# EAGLE board decel_control (EAGLE 9.6.2), part 1 of 2
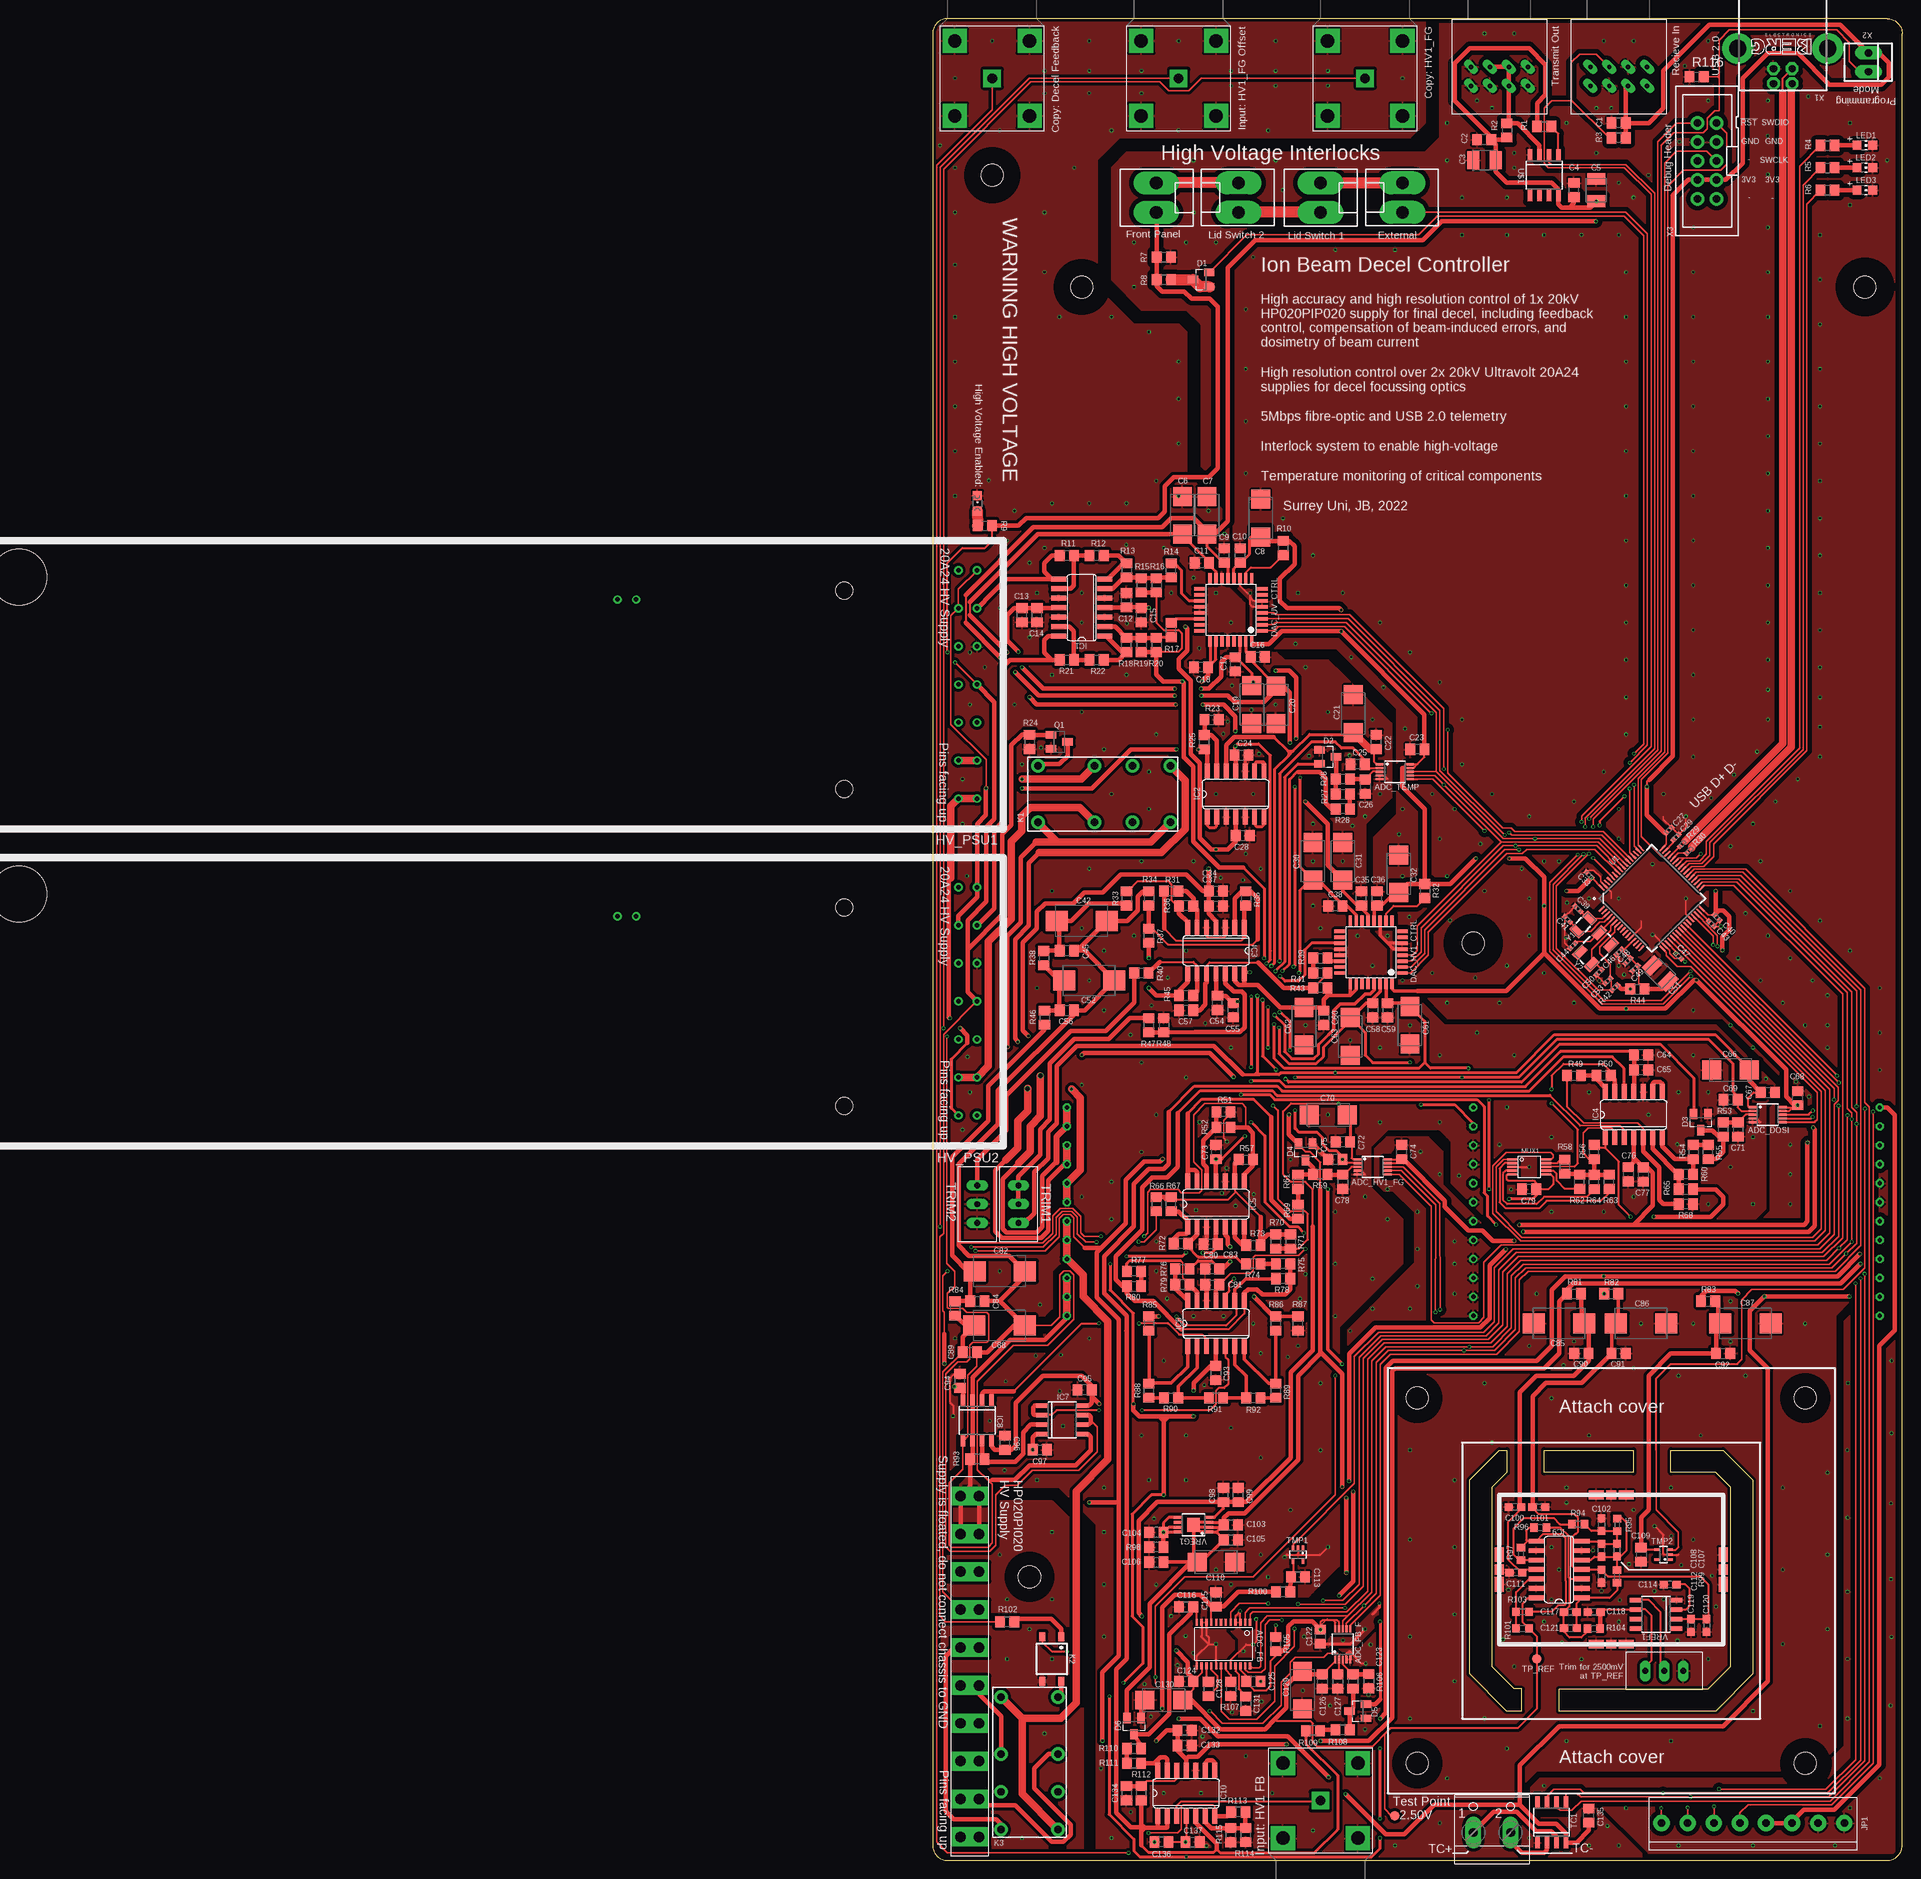
[diagram p8: board, top side]
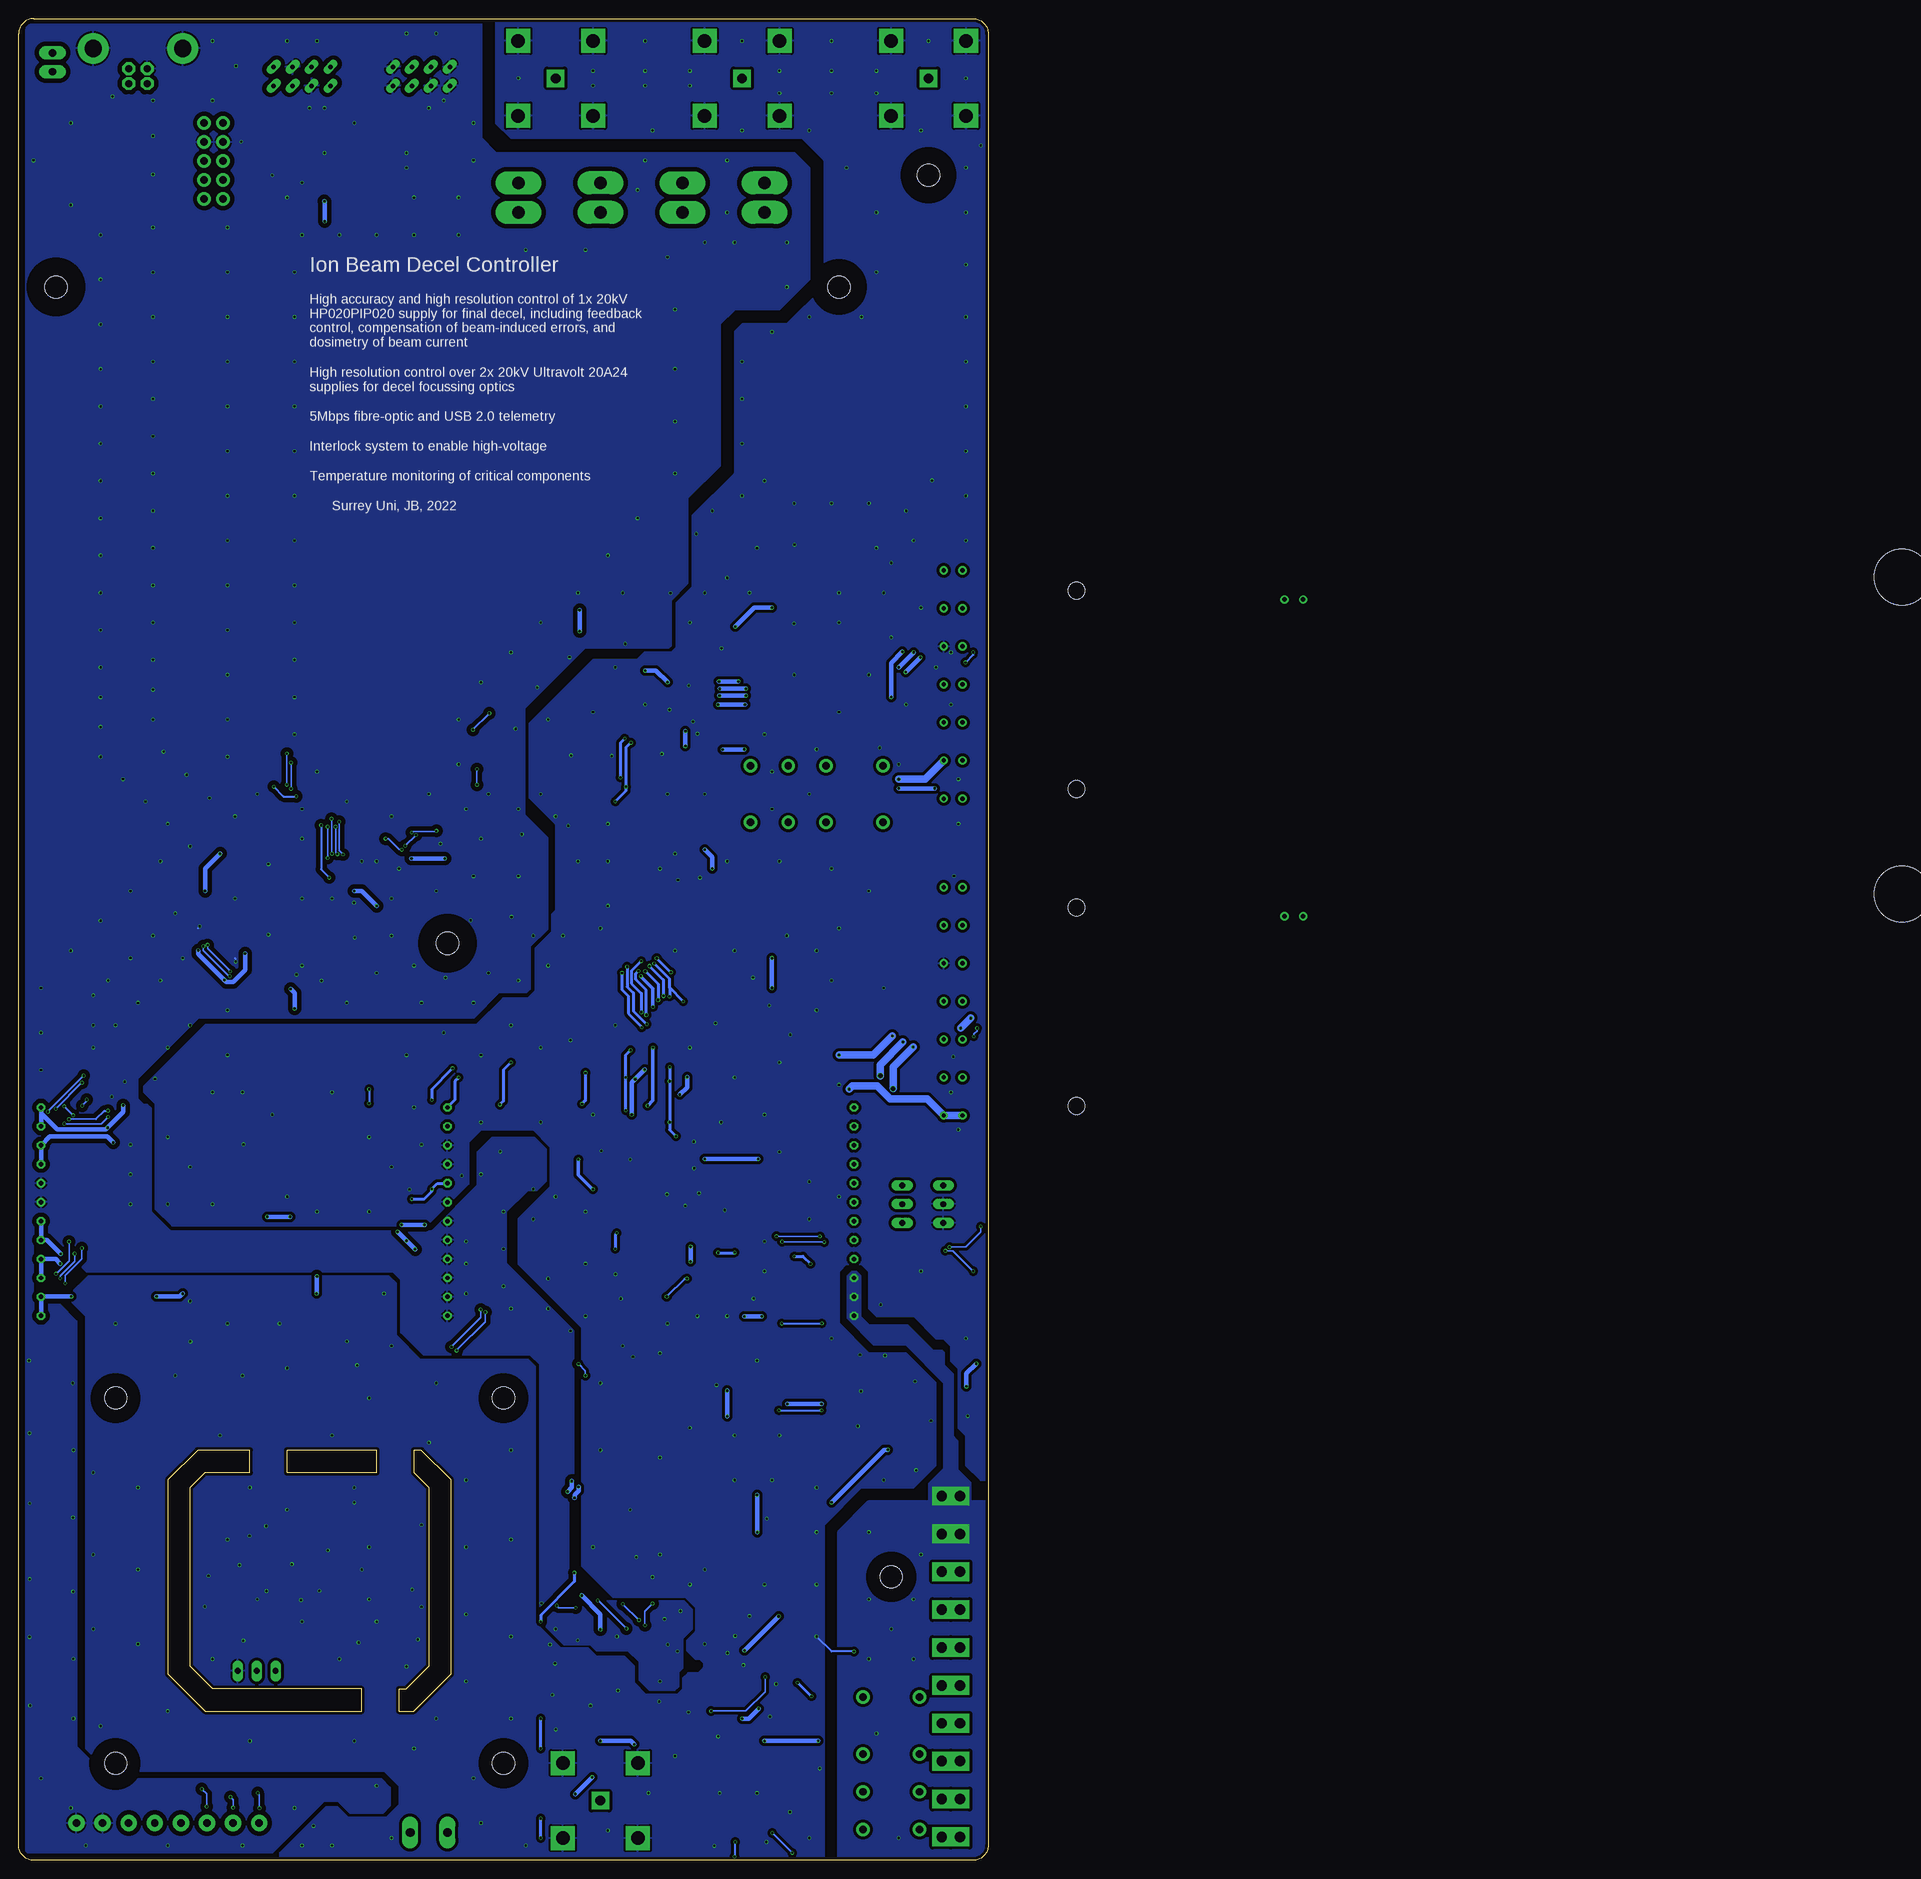
[diagram p9: board, bottom side, seen from below]

Size 130 x 247 mm. Coordinates in mm from the lower left corner, seen from the top.
Outline: 2,0 128,0 arc90 130,2 130,245 arc90 128,247 2,247 arc90 0,245 0,2 arc90 2,0
Outline: 104,23 107,26 107,50 105,52 99,52 99,55 106,55 110,51 110,25 105,20 84,20 84,23 104,23
Outline: 94,52 82,52 82,55 94,55 94,52
Outline: 77,52 75,50 75,26 78,23 79,23 79,20 77,20 72,25 72,51 76,55 77,55 77,52
Copper layers (1*16): Top 0.035mm / dielectric 1.6mm / Bottom 0.035mm
Design rules "jlcpcb-2layers": minimum track width 5mil, minimum drill 0.3mm, track to track 5mil, track to pad 5mil, pad to pad 5mil, via to via 5mil, smd to smd 5mil, copper to edge 0.2mm, drill to drill 6mil, minimum pad ring 10mil, minimum via ring 3mil, stop-mask expansion 4mil, vias tented up to drill 0mil, thermal gap 10mil
Holes 3 mm at 8,226 65,62 117,62 117,13 65,13 13,38
tRestrict: area 5.2,223.2 to 10.8,228.8; area 62.2,10.2 to 67.8,15.8; area 114.2,10.2 to 119.8,15.8; area 114.2,59.2 to 119.8,64.8; area 62.2,59.2 to 67.8,64.8; area 10.2,35.2 to 15.8,40.8
bRestrict: area 5.2,223.2 to 10.8,228.8; area 62.2,10.2 to 67.8,15.8; area 114.2,10.2 to 119.8,15.8; area 114.2,59.2 to 119.8,64.8; area 62.2,59.2 to 67.8,64.8; area 10.2,35.2 to 15.8,40.8

## Footprints (pad centres in the part's own frame; a part is rotated, then mirrored left to right if it is on the bottom)
MSOP10 = smd 0.3 x 1: 1 -1,-2.05; 2 -0.5,-2.05; 3 0,-2.05; 4 0.5,-2.05; 5 1,-2.05; 6 1,2.05; 7 0.5,2.05; 8 0,2.05; 9 -0.5,2.05; 10 -1,2.05
TSSOP24 = smd 0.305 x 0.991: 1 -3.575,-2.918; 2 -2.925,-2.918; 3 -2.275,-2.918; 4 -1.625,-2.918; 5 -0.975,-2.918; 6 -0.325,-2.918; 7 0.325,-2.918; 8 0.975,-2.918; 9 1.625,-2.918; 10 2.275,-2.918; 11 2.925,-2.918; 12 3.575,-2.918; 13 3.575,2.918; 14 2.925,2.918; 15 2.275,2.918; 16 1.625,2.918; 17 0.975,2.918; 18 0.325,2.918; 19 -0.325,2.918; 20 -0.975,2.918; 21 -1.625,2.918; 22 -2.275,2.918; 23 -2.925,2.918; 24 -3.575,2.918
BNC_RS = drill 1.8 square: P$1 -5.02,-5.03; P$2 -5.02,5.02; P$3 5.03,5.02; P$4 5.03,-5.03 | drill 1.3 square: P$5 0.005,-0.005
C0805 = smd 1.3 x 1.5: 1 -0.95,0; 2 0.95,0
SMC_B = smd 1.6 x 2.4: + -1.5,0; - 1.5,0
C/6032-28R = smd 2.55 x 2.5: + 2.525,0; - -2.525,0
0402-TIGHT = smd 0.6 x 0.6: 1 -0.5,0; 2 0.5,0
D/7343-31W = smd 2.95 x 2.7: + 3.375,0; - -3.375,0
C0603 = smd 1.1 x 1: 1 -0.85,0; 2 0.85,0
RFI_SHIELD_CLIP = smd 1.4 x 1.2: P$1 0,0 | smd 2 x 1.2: P$2 -2,0; P$3 2,0
PSU_CONNECTION = drill 1.4 square: P$1 0,0; P$2 5.08,0; P$3 10.16,0; P$4 15.24,0; P$5 20.32,0; P$6 25.4,0; P$7 30.48,0; P$8 35.56,0; P$9 40.64,0; P$10 45.72,0; P$11 0,-2.46; P$12 5.08,-2.46; P$13 10.16,-2.46; P$14 15.24,-2.46; P$15 20.32,-2.46; P$16 25.4,-2.46; P$17 30.48,-2.46; P$18 35.56,-2.46; P$19 40.64,-2.46; P$20 45.72,-2.46
SOT23 = smd 1 x 1.4: 1 -0.95,-1.1; 2 0.95,-1.1; 3 0,1.1
TQFP-32 = smd 0.45 x 1.45: P$1 0,0; P$2 0.8,0; P$3 1.6,0; P$4 2.4,0; P$5 3.2,0; P$6 4,0; P$7 4.8,0; P$8 5.6,0; P$17 5.6,8.4; P$18 4.8,8.4; P$19 4,8.4; P$20 3.2,8.4; P$21 2.4,8.4; P$22 1.6,8.4; P$23 0.8,8.4; P$24 0,8.4 | smd 1.45 x 0.45: P$9 7,1.4; P$10 7,2.2; P$11 7,3; P$12 7,3.8; P$13 7,4.6; P$14 7,5.4; P$15 7,6.2; P$16 7,7; P$25 -1.4,7; P$26 -1.4,6.2; P$27 -1.4,5.4; P$28 -1.4,4.6; P$29 -1.4,3.8; P$30 -1.4,3; P$31 -1.4,2.2; P$32 -1.4,1.4
KK-156-2 = drill 1.7 pad 2.184 long: 1 -1.98,0; 2 1.98,0
HFBR-X41XZ = drill 0.6 long: P$1 0,-3.81; P$2 0,-1.27; P$3 0,1.27; P$4 0,3.81; P$5 2.54,3.81; P$6 2.54,1.27; P$7 2.54,-1.27; P$8 2.54,-3.81
CHIPLED_0805 = smd 1.2 x 1.2: A 0,-1.05; C 0,1.05
ULTRAVOLT_20A = drill 0.6: J1-1 3.5,-4.1; J1-2 3.5,-9.2; J1-3 3.5,-14.3; J1-4 3.5,-19.4; J1-5 3.5,-24.5; J1-6 3.5,-29.6; J1-7 3.5,-34.7; J1-8 6,-4.1; J1-9 6,-9.2; J1-10 6,-14.3; J1-11 6,-19.4; J1-12 6,-24.5; J1-13 6,-29.6; J1-14 6,-34.7; J2-1 49.2,-30.8; J2-2 51.7,-30.8 | hole 2.3: 21.3,-5.4; 21.3,-32 | hole 7.5: 132,-33.8
SO14 = smd 0.66 x 2.032: 1 -3.81,-3.073; 2 -2.54,-3.073; 3 -1.27,-3.073; 4 0,-3.073; 5 1.27,-3.073; 6 2.54,-3.073; 7 3.81,-3.073; 8 3.81,3.073; 9 2.54,3.073; 10 1.27,3.073; 11 0,3.073; 12 -1.27,3.073; 13 -2.54,3.073; 14 -3.81,3.073
SOIC8 = smd 0.6 x 1.5: 1 -1.905,-2.75; 2 -0.635,-2.75; 3 0.635,-2.75; 4 1.905,-2.75; 5 1.905,2.75; 6 0.635,2.75; 7 -0.635,2.75; 8 -1.905,2.75
1X4MTA = drill 1.676 long: 1 5.944,0; 2 1.981,0; 3 -1.981,0; 4 -5.944,0
1X08-3.5MM = drill 1 pad 2.184: 1 -12.25,0; 2 -8.75,0; 3 -5.25,0; 4 -1.75,0; 5 1.75,0; 6 5.25,0; 7 8.75,0; 8 12.25,0
FINDER-30.22 = drill 1 pad 1.6: 11 -1.27,-3.81; 12 3.81,-3.81; 14 8.89,-3.81; 21 -1.27,3.81; 22 3.81,3.81; 24 8.89,3.81; A1 -8.89,-3.81; A2 -8.89,3.81
SOP04 = smd 0.8 x 1.2: 1 -1.27,-3; 2 1.27,-3; 3 1.27,3; 4 -1.27,3
CHIP-LED0805 = smd 1.2 x 1.2: A 0,-1.05; C 0,1.05
VSSOP-10 = smd 1.45 x 0.3: P$1 -2.2,1; P$2 -2.2,0.5; P$3 -2.2,0; P$4 -2.2,-0.5; P$5 -2.2,-1; P$6 2.2,-1; P$7 2.2,-0.5; P$8 2.2,0; P$9 2.2,0.5; P$10 2.2,1
R0805 = smd 1.3 x 1.5: 1 -0.95,0; 2 0.95,0
R0603 = smd 1 x 1.1: 1 -0.85,0; 2 0.85,0
SC70-5L = smd 0.35 x 0.8: 1 -0.65,-0.85; 2 0,-0.85; 3 0.65,-0.85; 4 0.65,0.85; 5 -0.65,0.85
B1,27 = smd 1.27 x 1.27: TP 0,0
BOURNS_TRIMPOT = drill 0.8 long: P$1 0,-2.54; P$2 0,0; P$3 0,2.54
TQFP64 = smd 0.22 x 1: 1 -3.75,-5.75; 2 -3.25,-5.75; 3 -2.75,-5.75; 4 -2.25,-5.75; 5 -1.75,-5.75; 6 -1.25,-5.75; 7 -0.75,-5.75; 8 -0.25,-5.75; 9 0.25,-5.75; 10 0.75,-5.75; 11 1.25,-5.75; 12 1.75,-5.75; 13 2.25,-5.75; 14 2.75,-5.75; 15 3.25,-5.75; 16 3.75,-5.75; 33 3.75,5.75; 34 3.25,5.75; 35 2.75,5.75; 36 2.25,5.75; 37 1.75,5.75; 38 1.25,5.75; 39 0.75,5.75; 40 0.25,5.75; 41 -0.25,5.75; 42 -0.75,5.75; 43 -1.25,5.75; 44 -1.75,5.75; 45 -2.25,5.75; 46 -2.75,5.75; 47 -3.25,5.75; 48 -3.75,5.75 | smd 1 x 0.22: 17 5.75,-3.75; 18 5.75,-3.25; 19 5.75,-2.75; 20 5.75,-2.25; 21 5.75,-1.75; 22 5.75,-1.25; 23 5.75,-0.75; 24 5.75,-0.25; 25 5.75,0.25; 26 5.75,0.75; 27 5.75,1.25; 28 5.75,1.75; 29 5.75,2.25; 30 5.75,2.75; 31 5.75,3.25; 32 5.75,3.75; 49 -5.75,3.75; 50 -5.75,3.25; 51 -5.75,2.75; 52 -5.75,2.25; 53 -5.75,1.75; 54 -5.75,1.25; 55 -5.75,0.75; 56 -5.75,0.25; 57 -5.75,-0.25; 58 -5.75,-0.75; 59 -5.75,-1.25; 60 -5.75,-1.75; 61 -5.75,-2.25; 62 -5.75,-2.75; 63 -5.75,-3.25; 64 -5.75,-3.75
POWER_BOARD_DECEL = drill 0.6 octagon: P$1 142.97,3; P$2 140.43,3; P$3 137.89,3; P$4 135.35,3; P$5 132.81,3; P$6 130.27,3; P$7 127.73,3; P$8 125.19,3; P$9 122.65,3; P$10 120.11,3; P$11 117.57,3; P$12 115.03,3; P$13 115.03,57.5; P$14 117.57,57.5; P$15 120.11,57.5; P$16 122.65,57.5; P$17 125.19,57.5; P$18 127.73,57.5; P$19 130.27,57.5; P$20 132.81,57.5; P$21 135.35,57.5; P$22 137.89,57.5; P$23 140.43,57.5; P$24 142.97,57.5; P$25 142.97,112; P$26 140.43,112; P$27 137.89,112; P$28 135.35,112; P$29 132.81,112; P$30 130.27,112; P$31 127.73,112; P$32 125.19,112; P$33 122.65,112; P$34 120.11,112; P$35 117.57,112; P$36 115.03,112 | hole 3: 5,5; 93,57.5; 5,110
MSOP8 = smd 0.4 x 1.2: 1 -0.975,-2.05; 2 -0.325,-2.05; 3 0.325,-2.05; 4 0.975,-2.05; 5 0.975,2.05; 6 0.325,2.05; 7 -0.325,2.05; 8 -0.975,2.05 | smd 1.88 x 1.68: BOTTOM 0,0
PN61729-S = drill 0.95 octagon: 1 1.25,4.71; 2 -1.25,4.71; 3 -1.25,2.71; 4 1.25,2.71 | drill 2.3 pad 2.9: S1 -6.02,0; S2 6.02,0
22-23-2021 = drill 1 long: 1 -1.27,0; 2 1.27,0
PAK100/2500-10 = drill 1 pad 1.422: 1 -5.08,-1.27; 2 -5.08,1.27; 3 -2.54,-1.27; 4 -2.54,1.27; 5 0,-1.27; 6 0,1.27; 7 2.54,-1.27; 8 2.54,1.27; 9 5.08,-1.27; 10 5.08,1.27
W237-102 = drill 1.194 long: 1 -2.5,-1.27; 2 2.5,-1.27
CRYSTAL-SMD-3.2X1.5MM = smd 1 x 1.8: P$1 -1.25,0; P$2 1.25,0
CRYSTAL-SMD-5X3.2-4PAD = smd 1.9 x 1.1: 1 -1.85,-1.15; 2 1.85,-1.15; 3 1.85,1.15; 4 -1.85,1.15

## Placement (x,y rotation side)
ADC_FAST_HV1_FB  MCP33131  [MSOP10]  55,29 0 top
ADC_HV1_ELECTRODE_CURRENT  MCP33131  [MSOP10]  112,100 270 top
ADC_HV1_FG  MCP33131  [MSOP10]  59,93 270 top
ADC_SLOW_HV1_FB  MAX11270  [TSSOP24]  39,29 180 top
ADC_TEMP_DAC_HV1_CTRL  MCP33131  [MSOP10]  62,146 270 top
BNC_DECEL_COPY  BNC_RS  [BNC_RS]  8,239 270 top
C1  100n  [C0805]  92,233 180 top
C2  100n  [C0805]  73.95,230.78 180 top
C3  10u  [SMC_B]  74,228 180 top
C4  100n  [C0805]  86,224 90 top
C5  10u  [SMC_B]  89,224 90 top
C6  10u  [C/6032-28R]  33.5,180.4 90 top
C7  10u  [C/6032-28R]  36.8,180.4 270 top
C8  10u  [C/6032-28R]  44.01,180.01 270 top
C9  100n  [C0805]  39.1,175 90 top
C10  100n  [C0805]  41.24,175 90 top
C11  100n  [C0805]  36.1,174 180 top
C12  1n  [C0805]  26,169 90 top
C13  100n  [C0805]  12,167 90 top
C14  1n  [C0805]  14,167 90 top
C15  100n  [C0805]  28,167 270 top
C16  100n  [C0805]  43.6,161.4 0 top
C17  100n  [C0805]  40.57,160.4 270 top
C18  100n  [C0805]  36,160 180 top
C19  10u  [C/6032-28R]  42.8,155 270 top
C20  10u  [C/6032-28R]  46.04,154.97 90 top
C21  10u  [C/6032-28R]  56.4,153.8 270 top
C22  10n  [C0805]  59.5,150 90 top
C23  100n  [C0805]  65,149 180 top
C24  100n  [C0805]  41.43,148.24 0 top
C25  1u  [C0805]  57,147 180 top
C26  1.7n  [C0805]  58,144 270 top
C27  0.1uF  [0402-TIGHT]  98.73,138.16 45 top
C28  100n  [C0805]  41.59,137.43 0 top
C29  2.2uF  [0402-TIGHT]  99.69,137.21 45 top
C30  10u  [C/6032-28R]  51,134 90 top
C31  10u  [C/6032-28R]  55,134 270 top
C32  10u  [C/6032-28R]  62.5,132.3 270 top
C33  0.1uF  [0402-TIGHT]  88,132.15 135 top
C34  100n  [C0805]  38,130 0 top
C35  100n  [C0805]  57.5,129 90 top
C36  100n  [C0805]  59.6,129 90 top
C37  1n  [C0805]  38,128 0 top
C38  100n  [C0805]  54,128 180 top
C39  15pF  [0402-TIGHT]  86.54,127.61 135 top
C40  0.1uF  [0402-TIGHT]  105.18,126.43 315 top
C41  15pF  [0402-TIGHT]  85.12,126.19 135 top
C42  100u  [D/7343-31W]  20,126 180 top
C43  2.2uF  [0402-TIGHT]  104.43,125.62 315 top
C44  22pF  [0402-TIGHT]  85.83,122.66 225 top
C45  100n  [C0805]  18,122 0 top
C46  0.1uF  [0402-TIGHT]  92.04,121.82 225 top
C47  0.1uF  [0402-TIGHT]  100,121.27 315 top
C48  1.0uF  [0402-TIGHT]  93.22,120.63 225 top
C49  4.7uF  [0402-TIGHT]  94.21,119.63 225 top
C50  22pF  [0402-TIGHT]  89.36,119.12 225 top
C51  10u  [SMC_B]  97.56,118.95 135 top
C52  100u  [D/7343-31W]  21,118 180 top
C53  0.1uF  [0402-TIGHT]  90.54,117.95 225 top
C54  1n  [C0805]  38.2,115 90 top
C55  100n  [C0805]  40.3,114.01 90 top
C56  100n  [C0805]  18,114 0 top
C57  1u  [C0805]  34,114 180 top
C58  100n  [C0805]  59,114 270 top
C59  100n  [C0805]  61,114 270 top
C60  100n  [C0805]  52.45,112.98 270 top
C61  10u  [C/6032-28R]  64,112 90 top
C62  10u  [C/6032-28R]  49.81,111.87 90 top
C63  10u  [C/6032-28R]  56,110.5 270 top
C64  100n  [C0805]  95,108 180 top
C65  1n  [C0805]  95,106 180 top
C66  10u  [C/6032-28R]  107,106 0 top
C67  10n  [C0805]  112,103 0 top
C68  100n  [C0805]  115.99,102.22 90 top
C69  1u  [C0805]  107,102 180 top
C70  10u  [C/6032-28R]  53.05,99.97 0 top
C71  1.7n  [C0805]  108,98 270 top
C72  10n  [C0805]  55,96.36 180 top
C73  10n  [C0805]  38,95 270 top
C74  100n  [C0805]  62.91,95 90 top
C75  1u  [C0805]  54,94 180 top
C76  100n  [C0805]  93.26,92 270 top
C77  1n  [C0805]  95.28,91.98 270 top
C78  1.7n  [C0805]  55,91 270 top
C79  100n  [C0805]  80,90 180 top
C80  10n  [C0805]  37.29,82.63 180 top
C81  2n  [C0805]  37.5,79.3 180 top
C82  100u  [D/7343-31W]  9,79 180 top
C83  10n  [C0805]  37.5,77.2 0 top
C84  100n  [C0805]  6,75 0 top
C85  100u  [D/7343-31W]  84,72 0 top
C86  100u  [D/7343-31W]  95,72 180 top
C87  100u  [D/7343-31W]  109,72 180 top
C88  100u  [D/7343-31W]  8.97,71.73 180 top
C89  100n  [C0805]  5,68.15 0 top
C90  100n  [C0805]  87,68 180 top
C91  100n  [C0805]  92,68 0 top
C92  100n  [C0805]  106,68 0 top
C93  10n  [C0805]  37.97,65.37 270 top
C94  10n  [C0805]  3.67,64.3 90 top
C95  10n  [C0805]  20.39,63.08 180 top
C96  10n  [C0805]  9.71,56 90 top
C97  10n  [C0805]  14.39,55.08 0 top
C98  1n  [C0805]  39,49 90 top
C99  1u  [C0805]  41,49 90 top
C100  100n  [C0603]  78.1,47.4 180 top
C101  100n  [C0603]  81.3,47.4 0 top
C102  10u  [C0603]  89.67,45.03 270 top
C103  100n  [C0805]  40,45 0 top
C104  100n  [C0805]  30,44 180 top
C105  1u  [C0805]  40,43 0 top
C106  1u  [C0805]  30,42 180 top
C107  22u  [C0603]  91.8,41.6 90 top
C108  22u  [C0603]  89.68,41.58 90 top
C109  100n  [C0805]  95,41 270 top
C110  10u  [C/6032-28R]  38,40 180 top
C111  1n  [C0603]  78.2,38.6 180 top
C112  1n  [C0603]  89.7,38.1 270 top
C113  1u  [C0805]  49,38 0 top
C114  2u2  [C0603]  98.9,37 180 top
C115  1u  [C0805]  38,35 90 top
C116  10n_C0G  [C0805]  34,34 0 top
C117  22u  [C0603]  85.5,33.32 0 top
C118  10u  [C0603]  88.7,33.3 180 top
C119  10n  [C0603]  101.7,31.5 270 top
C120  2u2  [C0603]  103.8,31.5 270 top
C121  22u  [C0603]  85.52,31.12 0 top
C122  100n  [C0805]  52,30 270 top
C123  1.7n  [C0805]  58.47,24.03 270 top
C124  10n  [C0805]  34,24 0 top
C125  1u  [C0805]  43,24 0 top
C126  10n  [C0805]  52.27,23.99 270 top
C127  1u  [C0805]  54.33,23.99 270 top
C128  10n_C0G  [C0805]  37,23 270 top
C129  10u  [C/6032-28R]  49.6,22.84 90 top
C130  10u  [C/6032-28R]  31,21.5 0 top
C131  1u  [C0805]  42,21 270 top
C132  100n  [C0805]  33.81,17.42 180 top
C133  1n  [C0805]  33.81,15.4 180 top
C134  1u  [C0805]  26,9 270 top
C135  100n  [C0805]  88,6 90 top
C136  100n  [C0805]  30.7,2.46 180 top
C137  1n  [C0805]  34.87,2.46 0 top
CLIP1  RFI_SHIELD_CLIP  [RFI_SHIELD_CLIP]  91,49 180 top
CLIP2  RFI_SHIELD_CLIP  [RFI_SHIELD_CLIP]  76,39 90 top
CLIP3  RFI_SHIELD_CLIP  [RFI_SHIELD_CLIP]  106,39 90 top
CLIP4  RFI_SHIELD_CLIP  [RFI_SHIELD_CLIP]  91,29 180 top
CONN1  PSU_CONNECTOR  [PSU_CONNECTION]  3.77,3.14 90 top
D1  BAS40-04  [SOT23]  36,212 90 top
D2  BAS40-04  [SOT23]  53,148 270 top
D3  BAS40-04  [SOT23]  103,99 180 top
D4  BAS40-04  [SOT23]  50,95 180 top
D5  BAS40-04  [SOT23]  57,20 90 top
D6  BAS40-04  [SOT23]  27,18 180 top
DAC_HV1_CTRL  AD5763  [TQFP-32]  63,119 90 top
DAC_ULTRAVOLT_CTRL  AD5763  [TQFP-32]  44.2,164.91 90 top
EXT_INTERLOCK  [KK-156-2]  63,223 90 top
F_RX1  HFBR-2412-TZ  [HFBR-X41XZ]  92,238 90 top
F_TX1  HFBR-1412-TZ  [HFBR-X41XZ]  76,238 90 top
FRONT_PANEL_INTERLOCK  [KK-156-2]  30,223 270 top
HV_ENABLED_LED  [CHIPLED_0805]  6,182 0 top
HV_PSU1  ULTRAVOLT_20A  [ULTRAVOLT_20A]  9.46,138.3 180 top
HV_PSU2  ULTRAVOLT_20A  [ULTRAVOLT_20A]  9.46,95.8 180 top
IC1  ADA4522-4  [SO14]  20,168 90 top
IC2  ADA4522-4  [SO14]  40.63,143 0 top
IC3  ADA4522-4  [SO14]  38,122 180 top
IC4  ADA4522-4  [SO14]  94,100 0 top
IC5  ADA4522-4  [SO14]  38,88 0 top
IC6  ADA4522-4  [SO14]  38,72 0 top
IC7  AD8034  [SOIC8]  17.39,59.08 270 top
IC8  AD8034  [SOIC8]  6,59 180 top
IC9  ADA4522-4  [SO14]  84,39 90 top
IC10  ADA4522-4  [SO14]  34,9 0 top
IP_BNC_HV1_FB  BNC_RS  [BNC_RS]  52,8 90 top
IP_BNC_HV1_PSU_EXTERNAL_OFFSET  BNC_RS  [BNC_RS]  33,239 270 top
J1  [1X4MTA]  -127,-19 0 top  (outside the outline)
JP1  [1X08-3.5MM]  110,5 0 top
K1  FINDER-30.22  [FINDER-30.22]  23,143 0 top
K2  AQY41SOP  [SOP04]  16,27 180 top
K3  FINDER-30.22  [FINDER-30.22]  13,13 270 top
LED1  [CHIP-LED0805]  125,230 270 top
LED2  [CHIP-LED0805]  125,227 270 top
LED3  [CHIP-LED0805]  125,224 270 top
LID1_INTERLOCK  [KK-156-2]  52,223 270 top
LID2_INTERLOCK  [KK-156-2]  41,223 90 top
MUX1  TMUX1104  [VSSOP-10]  80,93 0 top
OP_BNC_HV1_FG_COPY  BNC_RS  [BNC_RS]  58,239 270 top
Q1  [SOT23]  17,150 270 top
R1  1k  [R0805]  82,232.54 0 top
R2  88  [R0805]  77,232 270 top
R3  560  [R0805]  92,231 180 top
R4  1000  [R0805]  120,230 0 top
R5  1000  [R0805]  120,227 0 top
R6  1000  [R0805]  120,224 0 top
R7  10k  [R0805]  31,215 180 top
R8  100  [R0805]  31,212 0 top
R9  200  [R0805]  7,179 0 top
R10  10k  [R0805]  47,176 270 top
R11  1000  [R0805]  18,175 0 top
R12  1000  [R0805]  22,175 0 top
R13  11k  [R0805]  26,173 270 top
R14  18k  [R0805]  32,173 90 top
R15  18k  [R0805]  28,171 270 top
R16  18k  [R0805]  30,171 270 top
R17  18k  [R0805]  32,165 90 top
R18  11k  [R0805]  26,163 90 top
R19  18k  [R0805]  28,163 270 top
R20  18k  [R0805]  30,163 270 top
R21  1000  [R0805]  18,161 0 top
R22  1000  [R0805]  22,161 0 top
R23  1000  [R0805]  37.42,152.98 0 top
R24  10k  [R0805]  13,150 270 top
R25  1000  [R0805]  36.43,149.96 90 top
R26  22  [R0805]  55,145 180 top
R27  1k  [R0805]  55,143 0 top
R28  1k  [R0805]  55,141 180 top
R29  22  [0402-TIGHT]  100.56,136.33 225 top
R30  22  [0402-TIGHT]  101.46,135.43 225 top
R31  10k  [R0805]  32,130 0 top
R32  10k  [R0805]  66,130 270 top
R33  10  [R0805]  26,129 270 top
R34  10k  [R0805]  29,129 270 top
R35  10k  [R0805]  42,129 270 top
R36  10k  [R0805]  34,128 180 top
R37  10k  [R0805]  29,124 90 top
R38  10  [R0805]  14.92,121 270 top
R39  1000  [R0805]  52,121 0 top
R40  7500  [R0805]  28,119 180 top
R41  1000  [R0805]  52,119 180 top
R42  5.1k  [0402-TIGHT]  91.47,117.05 45 top
R43  1000  [R0805]  52,117 180 top
R44  10  [R0805]  94.49,116.85 0 top
R45  20000  [R0805]  34,116 0 top
R46  10  [R0805]  15,113 270 top
R47  15000  [R0805]  29,112 90 top
R48  68000  [R0805]  31,112 270 top
R49  1000  [R0805]  86.01,105.26 0 top
R50  1000  [R0805]  89.99,105.26 0 top
R51  1k  [R0805]  39,100.38 180 top
R52  10k  [R0805]  39,98.27 0 top
R53  22  [R0805]  106,98 270 top
R54  1k  [R0805]  102,95 270 top
R55  1k  [R0805]  104,95 90 top
R56  1000  [R0805]  88.72,94.98 90 top
R57  1000  [R0805]  42,94 0 top
R58  1000  [R0805]  84.75,93.03 270 top
R59  22  [R0805]  52,92 180 top
R60  1000  [R0805]  101,92 180 top
R61  1k  [R0805]  49,91 270 top
R62  100  [R0805]  86.77,91 90 top
R63  1000  [R0805]  90.71,91 90 top
R64  1000  [R0805]  88.71,90.97 90 top
R65  1000  [R0805]  101,90 0 top
R66  dnf  [R0805]  30,88 270 top
R67  1000  [R0805]  32,88 90 top
R68  1000  [R0805]  101,88 180 top
R69  1k  [R0805]  49,87 270 top
R70  1000  [R0805]  46,83 270 top
R71  1000  [R0805]  48,83 270 top
R72  390  [R0805]  33.3,82.7 180 top
R73  1000  [R0805]  43,82.5 0 top
R74  20k  [R0805]  43,80 180 top
R75  330  [R0805]  47,80 180 top
R76  100k  [R0805]  33.5,79.3 0 top
R77  270  [R0805]  27,79 180 top
R78  1000  [R0805]  47,78 180 top
R79  1800  [R0805]  33.5,77.2 180 top
R80  430  [R0805]  27,77 0 top
R81  10  [R0805]  86,76 0 top
R82  10  [R0805]  91,76 0 top
R83  10  [R0805]  104,75 0 top
R84  10  [R0805]  3,74 270 top
R85  1000  [R0805]  29,72 270 top
R86  1000  [R0805]  46,72 270 top
R87  1000  [R0805]  49,72 90 top
R88  1300  [R0805]  29,63 90 top
R89  1300  [R0805]  46,63 270 top
R90  150.0  [R0805]  32,62 180 top
R91  1000  [R0805]  38,62 180 top
R92  150.0  [R0805]  43,62 180 top
R93  10k  [R0805]  6,53.8 180 top
R94  7k32  [R0603]  86.57,45.08 180 top
R95  5k11  [R0603]  91.8,45 270 top
R96  7k32  [R0603]  81.48,44.62 0 top
R97  7k32  [R0603]  78.9,41.1 90 top
R98  10k  [R0805]  30,40 0 top
R99  7k32  [R0603]  91.78,38.08 90 top
R100  100  [R0805]  47,36 180 top
R101  7k32  [R0603]  79.1,33.33 180 top
R102  560  [R0805]  10,32 0 top
R103  7k32  [R0603]  79.1,31.1 0 top
R104  7k32  [R0603]  88.67,31.08 180 top
R105  10k  [R0805]  46,29 270 top
R106  22  [R0805]  56.38,23.99 270 top
R107  10k  [R0805]  40,23 270 top
R108  1k  [R0805]  54.99,17.5 180 top
R109  1k  [R0805]  51.01,17.38 180 top
R110  1k  [R0805]  27,15 0 top
R111  1k  [R0805]  27,13 180 top
R112  1k  [R0805]  28,9 90 top
R113  82k  [R0805]  40.99,6.48 180 top
R114  1000k  [R0805]  42.01,3.39 90 top
R115  22k  [R0805]  40,3.38 90 top
R116  100k  [R0805]  102.45,239.21 0 top
TC1  MAX31855  [SOIC8]  83,5.1 0 top
TMP1  [SC70-5L]  49,41 180 top
TMP2  [SC70-5L]  98,41 90 top
TP_REF  TPB1,27  [B1,27]  81,27 90 top
TP_REF1  TPB1,27  [B1,27]  62,6 0 top
TRIM1  20  [BOURNS_TRIMPOT]  6,88 0 top
TRIM2  20  [BOURNS_TRIMPOT]  11.52,88 180 top
TRIM3  10k  [BOURNS_TRIMPOT]  98.1,25.4 270 top
U1  STM32F405RGT6  [TQFP64]  96.44,129.02 315 top
U$1  SN75451  [SOIC8]  82,226 180 top
U$2  POWER_BOARD_DECEL  [POWER_BOARD_DECEL]  15,216 270 top
VREF1  MAX6225ACSA+  [SOIC8]  97,33 90 top
VREG1  LT3085  [MSOP8]  35,45 90 top
X1  PN61729-S  [PN61729-S]  114,243 180 top
X2  22-23-2021  [22-23-2021]  125.46,241.15 270 top
X3  2510-  [PAK100/2500-10]  103.85,227.91 90 top
X4  [W237-102]  75,5 0 top
Y1  32.768kHz  [CRYSTAL-SMD-3.2X1.5MM]  87.24,125.49 45 top
Y2  12MHz  [CRYSTAL-SMD-5X3.2-4PAD]  88.88,122.28 225 top

## Tracks (layer width: path | path; a pad name or v marks a point on that pad's centre or on a via)
0  (via drill 0.3)
  Top 0.22: ADC_TEMP_DAC_HV1_CTRL.4 60.5,145.5 61,145 ADC_TEMP_DAC_HV1_CTRL.5 | R51.1 39.95,100.19 39.01,99.25 39.01,96.85 v39.47,96.39
  Top 0.3: ADC_HV1_FG.4 57.5,92.5 58,92 ADC_HV1_FG.5 | ADC_HV1_ELECTRODE_CURRENT.4 110.5,99.5 111,99 ADC_HV1_ELECTRODE_CURRENT.5 | MUX1.P$3 v80,93 | ADC_SLOW_HV1_FB.13 35.42,27.43 37,29 | 37,29 v38,29 38.02,28.98 ADC_SLOW_HV1_FB.17 | ADC_SLOW_HV1_FB.10 36.73,30.27 37,30 37,29 | ADC_SLOW_HV1_FB.11 36.08,30.07 36,30 37,29 | IC3.5 36.73,123.94 36.9,123.77 39.09,123.77 39.29,123.97 39.29,125.05 IC3.3 | v96.81,44.84 98,43.65 98,42.5 97.95,42.45 97.95,41.13 98.08,41 TMP2.2 100,41 | ADC_FAST_HV1_FB.4 55.5,27.67 55.87,28.04 | 55.87,28.04 55.99,28.04 56.04,27.99 56.04,26.99 ADC_FAST_HV1_FB.5 | 55.87,28.04 57.5,26.41 v58.08,26.41 | v47.19,40.65 47.52,40.98 48.84,40.98 | v53,42 51.98,40.98 48.84,40.98 | TMP1.2 49,41.14 48.84,40.98 | C94.2 2.94,65.25 2.32,64.63 2.32,61.44 2.75,61.01 v2.75,59.59 | K2.2 14.73,29.27 16,28 v18,28
  Top 0.45: IC2.10 41.9,147.76 C24.2
  Top 0.6: v36.73,1.94 36.34,1.94 C137.2 | D4.1 50.95,96.08 v51.89,95.14 53.03,94 C75.2 | C80.2 36.73,83.02 IC5.3 | IC6.12 36.73,77.02 C83.1 | D6.1 27.95,20.98 C130.-
  Bottom 0.3: v18,28 21,28 v23,30
  other vias: 99,50 102,43 85,50 76,45 76,34 78,26 82,32 87,27 92,32 104,27 96.78,36.1 98,35 75,56 70,51 70,42 70,33 70,24 74,19 64,19 64,30 64,43 64,55 74,64 83,62 94,66 88,57 103,57 114,50 114,39 114,29 110,20 99,16 85,16 77,15 69,11 120,52 120,41 120,31 119,18 109,65 100,65 95,72 102,72 117,72 28,57 29,51 34,57 34,51 40,58 44,54 52,64 52,55 48,47 44,41 38,39 29.69,45.81 30,37 23,44 23,37 33.93,30.1 53.31,20.74 42,14 31,9 36,9 45.54,9.04 51,4 17.48,58.22 17.05,62.91 7.67,58.93 9.81,64.23 17.2,67.79 13.83,67.69 14.4,74.51 31,67 44,68 43,72 40.62,87.78 35.33,87.19 24,86 24,91 28,95 30,100 34,105 28,107 20,104 20,89 40,109 36.57,112.26 29.35,114.65 23,122 27,124 16,130 21,133 28,134 35,134 42,135 44,133 38,143 43,143 51,128 52,125 57,124 59,120 60,109 64,112 53,100 70.58,91.82 68,99 60,99 58,89 54,87 54,80 54,73 59,78 61,86 49.98,78.61 49.26,75.34 49,69 47.62,67.52 21,70 5,103 4,98 4,139 4.6,132.01 4,145 29,146 29,141 24,143 23,149 30,151 14.54,149.22 12,147 11,155 20,154 16,159 26,159 20,170 20,166 26.05,165.87 32,170 38,170 40,166 35,172 31,176 25.97,176.45 13,174 15,176 14,170 9,168 13,164 7,160 5,162 11,181 16,182 21,182 26,182 30,185 33,190 33,196 33,201 29,205 24,207 17,207 15,213 15,221 19,227 24,232 33,232 45,232 46,238 40,238 53,238 21,237 15,237 28,237 21,240 15,240 28,240 40,240 46,240 53,240 63,239 46,244 33,244 21,244 8,244 3,239 9,232 3,227 1,230 3,221 3,214 3,207 3,201 3,195 3,189 3,183 3,177 7.54,185.05 37,181 33,183 68,108 78,108 73,111 77,101 83,97 88,103 96,100 100,103 104,103 102,108 110,97 107,93 104,88 94,89 90,87 83,87 110,88 80,69 81,76 50,112 56,110 55.92,148.18 50.48,148.11 46,155 40.15,157.55 35.76,162.54 50,160 53,154 59,153 60,143 56.3,138.74 51,139 55,134 51,134 58,140 43.76,148.38 29.75,2.46 80,3 90.48,4.62 88,2 92,2 77.58,89.98 76,96 99.85,96.02 89.68,36.14 38.64,131.8 41.6,131.48 34,122 42,122 39.43,92.84 38.79,89.48 35,73 39,73 31.45,75.35 30,79 107,75 106.98,69.58 83,42 84,39 83,35 77.23,36.29 85,48 94,47 99.04,43.51 100.38,39.6 93.37,39.71 92.14,34.91 99.87,29.45 105.04,34.04 104.53,38.16 84.41,29.2 76.47,29.62 58.74,28.92 58.44,22.2 49.63,22.78 57.98,17.56 44.11,21.3 40.17,19.85 32.83,26.17 34.95,27.8 39.15,177.9 88.54,41.58 40,37 45,38 31.99,32.74 26.57,6.48 111.73,104.81 85.99,69.6 84.61,66.39 36.43,63.75 28.43,23.65 29.25,19.26 36.21,16.62 38.97,151.09 39.58,152.73 42.74,154.31 62,2 68,5 22.58,12.33 24,3 23,50 14,51 9.66,52.31 30,83 43.07,89.32 48,94 35.81,99 9,79 3,70 4.69,107.76 21,118 23,114 14,117 20,125 31.54,118.39 26.54,110.74 5,155 10,177
  pour Top (isolate 0.4): 66,247 66,233 64,231 55,231 25,231 22,228 22,212 22,211 26,207 27,206 33,206 34,205 34,186 35,185 38,182 39.67,180.33 39.67,170.95 39.67,170.76 41.34,169.09 41.8,168.63 41.8,166.95 41.8,162.67 42.35,162.12 42.48,161.99 46.11,161.99 47,161.1 47,161 53,161 55,159 61.53,152.47 61.53,150.12 61.53,142.53 58,139 58,127.36 58.49,126.87 58.49,124.51 60.19,122.81 60.74,122.26 60.74,119.07 60.74,116.59 61.57,115.76 61.72,115.61 64.28,115.61 65.03,115.61 66.87,113.77 68.64,112 78,112 105,112 113.2,103.8 113.2,103.44 113.2,103.05 111.67,101.52 111.67,87.39 110.61,86.33 109.42,85.14 101.29,85.14 75.25,85.14 69.63,90.76 69.63,96.37 69,97 68,98 61,98 59,96 58.69,95.69 58.69,91.81 58.69,90.31 59,90 63,86 63,80 58,75 54.49,71.49 54.49,68.9 54.49,39.49 51,36 50.35,35.35 45.98,35.35 40.63,35.35 40.09,34.81 39.22,33.94 39.22,32.59 39.22,30.66 39.65,30.23 40.41,29.47 40.41,28.46 40.41,28.16 39.51,27.26 39.27,27.02 38.66,27.02 38.16,26.52 38.16,25.82 38.87,25.11 39.75,25.11 40.22,25.11 40.95,24.38 40.95,22.95 41.68,22.22 45.91,22.22 46.66,22.97 47.47,23.78 47.47,26.01 48.75,27.29 52.46,27.29 53.6,28.43 54.47,28.43 57.32,28.43 60.71,31.82 60.71,66.15 61.69,67.13 76.13,67.13 79,70 79.39,70.39 79.39,74 79.39,77.34 80.39,78.34 120.66,78.34 122,77 123,76 123,75 121,73 121,15 118,12 82,12 81,12 79,10 79,7.42 80.69,5.73 85.81,5.73 86.8,6.72 87.22,7.14 88.82,7.14 95,0.96 95,-1 95,-4 22,-4 22,28 22,45 17,50 11,50 10,50 7,53 7,64 11,68 16,68 18,70 20,72 20,78 20,79 19,80 17,80 16,79 16,74 15,73 10,73 7,70 6,70 5,69 5,67 4,66 4,65 4,58 3,57 3,53 1,51 -1,51 -1,246 1,248 65,248
  pour Bottom (isolate 0.4): 66,247 66,233 64,231 25,231 22,228 22,211 27,206 33,206 34,205 34,186 39.67,180.33 39.67,170.76 41.8,168.63 41.8,162.67 42.48,161.99 46.11,161.99 47,161.1 47,161 53,161 61.53,152.47 61.53,142.53 58,139 58,127.36 58.49,126.87 58.49,124.51 60.74,122.26 60.74,116.59 61.72,115.61 65.03,115.61 68.64,112 105,112 113.2,103.8 113.2,103.05 111.67,101.52 111.67,87.39 109.42,85.14 75.25,85.14 69.63,90.76 69.63,96.37 68,98 61,98 58.69,95.69 58.69,90.31 63,86 63,80 54.49,71.49 54.49,39.49 50.35,35.35 40.63,35.35 39.22,33.94 39.22,30.66 40.41,29.47 40.41,28.16 39.27,27.02 38.66,27.02 38.16,26.52 38.16,25.82 38.87,25.11 40.22,25.11 40.95,24.38 40.95,22.95 41.68,22.22 45.91,22.22 47.47,23.78 47.47,26.01 48.75,27.29 52.46,27.29 53.6,28.43 57.32,28.43 60.71,31.82 60.71,66.15 61.69,67.13 76.13,67.13 79.39,70.39 79.39,77.34 80.39,78.34 120.66,78.34 123,76 123,75 121,73 121,15 118,12 81,12 79,10 79,7.42 80.69,5.73 85.81,5.73 87.22,7.14 88.82,7.14 95,0.96 95,-4 22,-4 22,45 17,50 10,50 7,53 7,64 11,68 16,68 20,72 20,79 19,80 17,80 16,79 16,74 15,73 10,73 7,70 6,70 5,69 5,67 4,66 4,58 3,57 3,53 1,51 -1,51 -1,246 3,250 63,250
!RESET  (via drill 0.3)
  Top 0.22: U1.7 91.45,125.1 91.45,124.53 89.44,122.52 89.44,121.6 90.89,120.15 C53.1 91,118.19 91,116.7 | v88,135 83.65,130.65 83.65,122.3 89.25,116.7 91,116.7 | v88.04,139.69 v88.04,139.7 97.24,148.9 97.24,230.48 99.72,232.96 102.55,232.96 X3.10 | R42.1 91,116.7
  Bottom 0.22: v88,135 88.04,135.04 v88.04,139.69
+2.048V  (via drill 0.3, 0.35)
  Top 0.25: R16.2 30,166 31,165 33,165 33.41,164.59 33.41,162.54 32.92,162.05 R20.2
  Top 0.4: 37.2,160.25 38,161.05 DAC_ULTRAVOLT_CTRL.P$26 | DAC_ULTRAVOLT_CTRL.P$25 37.2,160.25 | 37.2,160.25 C18.1 | v42.53,119.1 42.5,119.07 41.81,119.07 IC3.14 | v44.44,120.98 44.44,130.36 41.64,133.16
  Top 0.45: DAC_HV1_CTRL.P$26 56.8,116.8 56,116 | 52.98,115.97 52.99,115.97 55.98,115.97 56,116 | DAC_HV1_CTRL.P$25 56,116
  Top 0.6: IC3.13 40.54,117.96 41.08,117.42 41.88,117.42 | IC3.14 41.81,117.49 41.88,117.42 | R15.2 R16.2 | R19.2 R20.2 30,159 30.9,158.1 v33.49,158.1 33.7,157.88 33.7,147.93 33.75,147.88 33.81,147.81 34.94,146.69 34.94,136.67 38.45,133.16 41.64,133.16 | C18.1 36.95,158.95 v36.1,158.1 | C60.1 52.45,115.43 52.99,115.97 | 41.88,117.42 42,117.42 43.58,117.42 46.6,114.39 C62.+ | 49.81,114.87 C62.+ | C60.1 52.34,113.82 | 52.98,115.97 52.98,116.97 R43.1 | C60.1 51.98,114.39 C62.+
  Bottom 0.4: v42.53,119.1 v42.54,119.1 44.42,120.98 v44.44,120.98
  Bottom 0.6: v36.1,158.1 v33.49,158.1
+3V3_CLEAN
  Top 0.3: TMP2.4 95.3,41.65 C109.1
  Top 0.6: 105.31,71.69 105.05,71.42 C92.1 99,68 96,65 96,47 95,46 C109.1 | 105.31,71.69 C87.+ 105,72.62 | R83.2 105.31,74.64 105.31,71.69
+12V  (via drill 0.3)
  Top 0.3: C136.1 C137.1 34,2.54 IC10.4
  Top 0.4: 31.02,44.02 C104.1 30.95,45.25 31.68,45.98 VREG1.5 | 31.02,44.02 VREG1.8 | VREG1.7 31.68,44.67 31.02,44.02 | v31,49 29.35,49 26.76,46.41 26.76,32.73 28.19,31.3 28.19,26.42 v25.58,23.81 | v23.7,21.99 23.68,21.97 23.68,6.15 27,2.83 27,1.28 27.86,0.42 33.95,0.42 v34.01,0.48 34.06,0.43 58.83,0.43 60,1.6 v60,3 | v60,5.62 v60,15 | v26.93,61.21 26.93,73.37 23.82,76.48 23.82,79.97 23.83,79.97 v23.83,79.99 | C80.1 38.24,82.28 37.45,81.49 v36.21,81.49 | v33.99,81.52 33.49,81.02 26.02,81.02 v26,81
  Top 0.6: IC8.8 7.91,55.49 8.35,55.05 C96.1 10.56,55.05 11.12,55.61 11.12,61.33 14.79,65 20,65 21.34,63.66 C95.1 | IC7.8 21,60.98 21.34,61.33 C95.1 | IC6.4 37.97,68.9 C93.1 37.27,66.32 35,64.05 v35,63 | C80.1 38,82.87 IC5.4 | C106.1 C104.1 | v34.99,59.55 31.59,59.55 | 31.59,59.55 30.41,59.55 | 30.41,59.55 27.73,59.55 26.93,60.35 v26.93,61.21 | v22.35,61.21 21.34,62.22 C95.1 | v31,49 31,58.96 | 31,58.96 31.59,59.55 | 31,58.96 30.41,59.55 | v60,19 60.77,19.77 60.77,66.07 61.7,67 81,67 83,69 83,76.48 84.84,78.32 v90,78.32 121.34,78.32 v124.34,81.32 v124.34,81.33
  Bottom 0.3: v34.01,0.48 33.92,0.57 C137.1
  Bottom 0.4: v25.58,23.81 25.54,23.81 23.7,21.97 v23.7,21.99 | v60,3 v60,5.62 | v60,15 v60,19 | v36.21,81.49 34.02,81.49 v33.99,81.52 | v26,81 24.84,81 v23.83,79.99
  Bottom 0.6: v35,63 v35,59.56 v34.99,59.55 | v26.93,61.21 26.91,61.23 22.37,61.23 v22.35,61.21 | C104.1 31,44.05 v31,49 | R82.1 90.05,78.27 v90,78.32 | v124.34,81.33 v124.35,81.33 125,81.98 125,82 126.2,83.19 U$2.P$29 U$2.P$30
  other vias: 30.95,44 90.05,76 33.92,2.46
+12V_CLEAN
  Top 0.22: 91.62,75.67 R82.2
  Top 0.3: 99.77,32.35 C119.1 C120.1 104,32.55 104,37 102.9,38.1 90.55,38.1 C112.1 87.12,38.95 | IC9.4 86.2,39 85.74,39.46 85.74,43.35 86.19,43.8 86.3,43.8 86.57,44.07 86.57,45.9 86.07,46.4 81.3,46.4 80.45,47.25 C101.1
  Top 0.45: R82.2 91.95,72.33 C86.+ 91.05,71.42 C91.1
  Top 0.6: 99.77,32.35 VREF1.2 | 87.12,38.95 IC9.4 | 80.45,47.25 80.45,62.2 82.25,64 87.05,64 C91.1 | R82.2
+24V  (via drill 0.3)
  Top 0.4: v75.57,85.25 74.41,86.41 74.41,89.06 73.96,89.51 73.96,101.08 73,102.04 45.87,102.04 45.22,102.69 v41.36,102.69
  Top 0.6: C34.1 C37.1 37.05,126.95 38,126 IC3.4 | IC1.4 25.95,168 C12.1 28,168.05 28.05,168 | IC4.4 94,94.21 | 94,94.21 94,93.69 C76.1 | 94,94.21 C77.1 95.82,92.93 96.57,92.18 96.57,87.82 94,85.25 | IC2.4 40.64,139.92 C28.1 40.64,136.64 39.57,135.57 v38,135.57 37.35,135.57 35.83,137.09 35.83,147.17 34.61,148.39 34.61,158.22 33,159.83 33,161.13 34.13,162.26 34.13,165.22 v33.9,165.45 | C15.1 28.05,168 | 28.05,168 v29,168 | C34.1 37,130.05 v37,133 | C34.1 36.22,130 34.02,132.2 25.23,132.2 22.82,129.79 20.33,129.79 18.86,128.32 15.09,128.32 14,127.23 14,125 12.09,123.09 12.09,111.31 v12.85,110.55 | 94,85.25 v78.66,85.25 | v20,108 20.25,108.25 37.17,108.25 v40.37,105.05 | 94,85.25 116.89,85.25 117.31,85.67 117.31,94 v117.31,96.24 v117.32,96.25
  Bottom 0.6: v29,168 31.35,168 v33.9,165.45 | v37,133 37,134.57 v38,135.57 | v78.66,85.25 v75.57,85.25 | v40.37,105.05 40.37,103.68 v41.36,102.69 | v117.32,96.25 118.12,97.05 125.84,97.05 U$2.P$34 U$2.P$33
  Bottom 1: v12.85,110.55 15.4,108 v20,108
+24V_FG
  Top 1: K3.A1 12,19.08 | 12,19.08 12,8.92 K3.24 | U$2.P$6 U$2.P$5 18,82 U$2.P$4 18.07,80.65 20.19,78.53 20.19,75.6 23.52,72.27 23.52,53.75 19.28,49.51 19.28,21.14 17.22,19.08 12,19.08
+24V_ULTRAVOLT_A  (via drill 0.3, 0.6)
  Top 0.6: U$2.P$9 17.66,93.35 15.49,91.18 15.49,84.39 14.56,83.46 9.28,83.46 8.42,84.32 8.42,92.53 9.79,93.9 | v10.06,109.09 10,109.15 10,123.99 11.81,125.8 11.81,134.5 13.87,136.56
  Top 1: K1.14 29.26,136.56 16.74,136.56 | 16.74,136.56 K1.A1 | U$2.P$9 18,95 | 18,95 U$2.P$10 | 9.79,93.9 11.44,95.55 11.44,99.16 12.75,100.47 v12.75,103.5 | 13.87,136.56 16.74,136.56 | 18,95
  Bottom 1: v12.75,103.5 12.75,106.37 10.06,109.06 v10.06,109.09
+24V_ULTRAVOLT_B  (via drill 0.3, 0.6)
  Top 0.6: 16.61,93.65 14.72,91.76 14.72,84.98 13.97,84.23 9.85,84.23 9.4,84.68 9.4,91.39 11.57,93.56 | 14.29,135.15 12.89,133.75 12.89,125.35 11.06,123.52 11.06,110.22 11.43,109.85 v11.43,109.75
  Top 0.8: U$2.P$11 16.61,97.04 16.61,93.65
  Top 1: K1.24 33.86,144.84 33.86,138.32 30.69,135.15 14.29,135.15 | U$2.P$11 18,100 U$2.P$12 | 11.57,93.56 13.1,95.09 13.1,98.43 14.47,99.8 v14.47,105.22
  Bottom 1: v14.47,105.22 14.49,105.24 14.49,106.69 v11.43,109.75
+A1V8  (via drill 0.3)
  Top 0.22: ADC_FAST_HV1_FB.2 54.5,27.56 54.27,27.79 53.02,27.79 52.46,27.23 48.6,27.23 47.94,26.57 47.94,25.09 46.73,23.88 46.73,20.81 44.28,18.36 38.87,18.36 37.2,20.03 v37.15,20.03 | 29.89,23.73 v29.89,24.58 29.89,34.08 33.81,38 43,38 54,49 v54,65
  Top 0.3: C127.1 54.5,25.11 ADC_FAST_HV1_FB.2 | C25.1 58.45,146.5 ADC_TEMP_DAC_HV1_CTRL.2 | ADC_HV1_FG.2 55.45,93.5 C75.1 | C69.1 107.95,100.99 108.44,100.5 ADC_HV1_ELECTRODE_CURRENT.2
  Top 0.4: C75.1 54.95,94.38 54.18,95.15 53.17,95.15 52.3,96.02 52.3,96.9 51.55,97.65 49.1,97.65 48.6,98.15 v48.6,100.57 | C25.1 57.95,147.59 56.4,149.14 54.86,149.14 54,150 50.78,150 46.53,145.75 46.53,120.61 v46.52,120.6 | v47.94,108.66 47.94,112.47 46.67,113.74 v46.51,113.74 | C69.1 107.95,102.45 107.33,103.07 107.33,106.83 104.07,110.09 83.71,110.09 78.62,105 v71,105 69,105 v48.6,105
  Top 0.45: v53,90 53,68.49 v54.92,66.57
  Bottom 0.22: v37.15,20.03 32.49,20.03 29.89,22.63 v29.89,24.58 | v54,65 54,65.65 v54.92,66.57
  Bottom 0.4: v48.6,100.57 v48.6,105 48.6,108 v47.94,108.66 | v46.51,113.74 46.51,116.28 47.84,117.61 47.84,119.28 v46.52,120.6 | v71,105 71.5,104.5 71.5,102 72.5,101 U$2.P$13
  Bottom 0.45: C75.1 54.95,91.95 v53,90
  other vias: 54.95,94
+A3V3  (via drill 0.3)
  Top 0.3: ADC_SLOW_HV1_FB.9 37.38,33.42 C115.1
  Top 0.6: R100.2 41,36 39.05,34.05 C115.1 37.44,34.05 37.24,34.24 35.86,35.63 32.46,35.63 30.78,33.95 30.78,33 v30.78,20.35 | C135.1 88,4 86.35,2.35 TC1.4 84.91,3.62 83.6,4.93 81.28,4.93 78.76,7.45 | 78.76,7.45 78.76,12.76 84,18 106,18 112,24 112,66 109.59,68.41 109.59,73.68 v111.53,75.62 v122.93,75.62 | v33,19 35.88,19 38.24,16.64 47.6,16.64 v53.09,11.15 v53.1,11.15 | v55.37,8.88 60.77,3.48 63.27,3.48 67.24,7.45 78.76,7.45 | R83.1 103.05,75.72 103.71,76.38 107.62,76.38 v108,76
  Bottom 0.6: v30.78,20.35 32.13,19 v33,19 | v55.37,8.88 v53.1,11.15 | v122.93,75.62 126.95,75.62 U$2.P$26 U$2.P$25 | v108,76 108.38,75.62 v111.53,75.62
+A5V  (via drill 0.3)
  Top 0.3: MUX1.P$6 82.88,92 83.21,91.67 83.21,90.67 82.54,90 C79.1 | C79.1 | C7.+ 36.8,178.2 | 4.42,169.72 4.42,166 | MUX1.P$5 77.11,92 76.95,91.84 76.95,91.39 77.17,91.17 80.6,91.17 80.96,90.81 C79.1
  Top 0.4: DAC_ULTRAVOLT_CTRL.P$31 42,162.05 C16.1 42.65,160.95 46.04,157.56 C20.+ | DAC_ULTRAVOLT_CTRL.P$13 39.6,173.55 C9.1 38.95,174.05 36.8,176.2 C7.+ | C61.+ 66,112.53 66,107 | 66,107 65.22,106.22 56,106.22 47.18,106.22 45.77,107.63 45.77,112.1 v45.79,112.12 | v48.41,119.84 48.57,120 v48.57,144 | C79.1 80.95,89.2 80.45,88.7 v77.31,88.7 v77.3,88.69 | v74.61,101.97 v74.6,101.96 v74.6,90.03 | v71.84,106.21 71.81,106.24 66.76,106.24 66,107
  Top 0.45: DAC_HV1_CTRL.P$13 58.4,126.8 57.5,127.7 C35.1 56.95,128.05 55,130 C31.+ | DAC_HV1_CTRL.P$31 60.8,115.15 C59.1 63.58,114.95 C61.+
  Top 0.6: R2.2 76.73,230.78 C2.1 | C2.1 75.5,230.18 C3.+ 75.5,226.5 77,225 83,225 83.91,224.09 U$1.8 83.91,222.09 84.33,221.67 85.45,221.67 | C5.+ 88.17,221.67 85.45,221.67 | C4.1 86,222.22 85.45,221.67 | R1.1 81.05,235.67 82.18,236.8 82.18,240.82 80,243 72,243 70,241 70,236 74.9,231.1 C2.1 | C7.+ 36.92,178 38,178 39.58,179.58 39.58,213.58 43.27,217.26 65.73,217.26 68.3,219.83 88.93,219.83 v88.95,219.81 | 36.8,178.2 35,180 32,180 30.81,178.81 13.51,178.81 4.42,169.72 | v36.04,156.2 39.61,156.2 40.49,155.32 44.38,155.32 46.04,156.98 C20.+ 46.54,158 47.91,156.63 v47.91,149.9 | v32.48,156.2 14.22,156.2 v11.07,159.35 | 4.42,166 v9.09,161.33 | v50,142 53,139 53,133.47 C31.+
  Bottom 0.4: v50,142 48.57,143.43 v48.57,144 48.57,149.24 v47.91,149.9 | v45.79,112.12 v45.8,112.12 47.58,113.89 47.58,116.33 48.4,117.15 v48.4,119.83 v48.41,119.84 | v77.3,88.69 75.62,88.69 74.6,89.71 v74.6,90.03 73.85,90.78 72.53,90.78 U$2.P$17 | v74.61,101.97 74.61,103.41 71.84,106.18 v71.84,106.21
  Bottom 0.6: v36.04,156.2 v32.48,156.2 | v9.09,161.33 v11.07,159.35 | v88.95,219.81 88.95,222.45 C5.+
  other vias: 89,222.5
+D3V3  (via drill 0.3)
  Top 0.152: C122.1 52,31.45 53,32.45
  Top 0.22: C27.1 98.38,136.27 U1.48 | U1.32 103.97,126.79 C40.1 | C33.1 U1.64 | C47.1 99.65,121.92 U1.19 | U1.42 100.75,134.4 | U1.43 100.04,134.4 100.75,134.4 | v103,135 102.4,134.4 100.75,134.4 | C125.1 42.05,24.75
  Top 0.3: ADC_SLOW_HV1_FB.22 41.27,25.52 42.05,24.75 | ADC_HV1_FG.10 62.7,94 | C74.1 62.79,94.09 62.7,94 | ADC_HV1_FG.9 62.2,93.5 62.7,94 | C125.1 42.05,23.85 43.1,22.8 44.76,22.8 45.29,23.33 45.29,26.72 46,27.43 R105.2 | ADC_FAST_HV1_FB.10 54,31.9 53.7,32.2 | 53.7,32.2 52.3,32.2 52,31.9 C122.1 | ADC_FAST_HV1_FB.9 54.5,31.9 54.2,32.2 53.7,32.2 | 64.45,146.5 ADC_TEMP_DAC_HV1_CTRL.9 64.5,146.5 65,147 | ADC_HV1_ELECTRODE_CURRENT.10 115.36,101 | 115.36,101 115.63,101.27 | ADC_HV1_ELECTRODE_CURRENT.9 114.86,100.5 115.36,101 | 65,147 ADC_TEMP_DAC_HV1_CTRL.10 63.5,147 62.96,146.46 | 65,147 65.95,147.95 C23.1 | 43.1,163.1 42.8,163.4 DAC_ULTRAVOLT_CTRL.P$32 | 96.08,144.91 95.79,144.62 v95.79,144 | v92.77,142.7 89.44,139.37 v89.44,138.81
  Top 0.4: DAC_ULTRAVOLT_CTRL.P$12 40.4,173.21 C10.1 41.35,174.05 42.5,175.2 42.5,177.3 42.69,177.49 43,177.49 C8.+
  Top 0.45: DAC_HV1_CTRL.P$12 59.2,127.65 C36.1 60.25,128.05 61.98,129.78 C32.+ | DAC_HV1_CTRL.P$32 61.6,116.9 61.9,116.6 65,116.6
  Top 0.6: 43,177.49 43.53,176.95 R10.1 47.85,176.95 48.54,176.26 48.54,173.86 46.58,171.9 46.58,168.9 47.55,167.93 54.53,167.93 v54.79,167.67 | C32.+ 63.67,130.95 R32.1 | F_RX1.P$2 92.95,237.68 C1.1 | C1.1 R3.1 | C1.1 96,233 98,235 98,240 104.15,246.15 121.73,246.15 X2.1 126.87,242.42 128.2,241.09 128.2,239.17 127.2,238.17 120.26,238.17 116.07,242.36 111.95,242.36 108.6,239.01 108.6,227.61 106.36,225.37 X3.3 X3.4 101.31,225.37 99.27,223.33 99.27,148.1 96.08,144.91 | v95.79,144 95.79,140.17 98.16,137.8 C27.1 | v105,130 105,126.96 C40.1 105.43,127.39 106.03,127.39 106.83,126.59 106.83,124.78 105.91,123.86 v105.91,122.05 | C68.1 115.63,101.27 114.44,102.46 114.44,106.04 v102.42,118.06 102.1,118.06 98.27,114.23 v93,114.23 89.46,114.23 82,121.69 | v85,130 86.55,130 C33.1 | 82,121.69 v82,128 82,131.85 79.49,134.36 v77.33,134.36 | 65,116.6 76.91,116.6 82,121.69 | R32.1 66,141 62.96,144.04 62.96,146.46 | C23.1 65.95,153.67 v54.79,164.83 46.8,164.83 45.07,163.1 43.1,163.1 | R32.1 69.42,130.95 72.83,134.36 v72.85,134.36 | R105.2 46.87,28.05 47.71,28.89 47.71,31 47.71,31.36 48.41,32.06 50.89,32.06 C122.1 | v118.07,98.27 118.29,98.05 118.29,85.11 117.48,84.3 v79.19,84.3 | v76.85,81.96 74.69,79.8 74.69,72.71 73.45,71.47 59.39,71.47 55.85,67.93 v55.85,50.87 | v77.97,83.09 v77.98,83.09 75.09,83.09 73.72,84.47 71.82,84.47 68.69,87.6 68.69,88.45 63.09,94.05 C74.1 | v56.4,49.44 56.42,49.42 56.42,37.43 v54.51,35.52 | JP1.5 JP1.6 115.25,5.25 116.8,6.8 120.93,6.8 126.92,12.79 126.92,68.96 129.04,71.08 129.04,99.96 128,101 127.03,101 U$2.P$36 | R42.2 92.37,116.85 R44.1
  Bottom 0.3: v95.79,144 94.49,142.7 v92.77,142.7 | v89.44,138.81 89.44,132.89 C33.1
  Bottom 0.6: v103,135 105,133 v105,130 | C47.1 99.65,119.39 101.22,117.82 102.18,117.82 v102.42,118.06 v102.42,118.07 105.91,121.56 v105.91,122.05 | v82,128 84,130 v85,130 | v54.79,164.83 v54.79,167.67 | v72.85,134.36 v77.33,134.36 | C68.1 115.99,100.35 v118.07,98.27 118.34,98 124.84,98 127,100.16 U$2.P$36 U$2.P$35 | v79.19,84.3 v77.98,83.09 v76.85,81.96 | v55.85,50.87 55.85,49.99 v56.4,49.44 | v54.51,35.52 52,33.01 C122.1 | v93,114.23 93,116.31 R44.1
  other vias: 99.65,121.63 115.99,101.27 52,30.95 93.54,116.85 88.35,131.8
+D3V3_CLEAN
  Top 0.22: U1.13 92.77,122.17 C46.1 C48.1 94.57,120 C49.1 94.67,119.88 94.67,117.63 R44.2
  Top 0.6: R44.2 97.85,116.85 98.62,117.62 C51.+
-12V  (via drill 0.3)
  Top 0.22: 1.59,70.59 1.59,73.49 1.39,73.69 1.39,78.39 v2,79 | v5.75,81.74 15.12,81.74 16.99,83.61 16.99,86.06 17.53,86.6 18.49,86.6 18.92,86.17 18.92,83.63 20.41,82.14 | v50,82 49.1,81.1 43.24,81.1 43,80.86 43,79.11 42.61,78.72 39.97,78.72 C83.2
  Top 0.4: C24.1 40.48,149.31 v40.6,149.43 40.9,149.73 43.72,149.73 45.28,148.17 45.28,122 45.28,120.77 v44.79,120.28 v44.79,120.29 | v40.89,115.19 40.66,114.96 C55.2 | v42.73,115.85 42.73,106.42 v42.7,106.39 | v41.87,97.12 38.8,94.05 C73.2 | v42.71,99 44.55,97.16 44.55,88.28 47.83,85 48.94,85 v49.8,84.14 | C64.2 93.59,108.46 84.18,108.46 79.49,103.77 47.31,103.77 46.58,104.5 v42.71,104.5
  Top 0.6: IC10.11 34,13.57 | 34,13.57 32.86,14.71 C133.2 C132.2 31.42,17.42 v30,16 | C83.2 38,76.43 IC6.11 | C97.1 13.44,56.73 13.89,57.18 IC7.4 | IC3.11 38.02,118.91 38.02,116.13 C54.2 39.31,115.95 C55.2 | IC5.11 C73.2 | IC1.11 16.88,167.95 C14.2 C13.2 10.95,167.95 10,167 10,163.58 v11.5,162.08 | C64.2 C65.2 94.05,103.12 IC4.11 | C24.1 40.63,148.09 IC2.11 | IC8.4 4.09,62.92 C94.1 3.12,63.35 v2.92,63.55 | v22.78,16.02 v22.77,16.03 22.77,25.22 24.95,27.4 24.95,48 | v21,48 24.95,48 | v1.59,66.61 1.59,70.59 | v13,156 14,155 v32.6,155 | v36.22,154.99 39.01,154.99 40.6,153.4 v40.6,151.44 | 24.95,48 24.95,72.57 22.03,75.49 22.03,81.53 22.64,82.14 | v30.83,94.05 30.51,93.73 28.39,93.73 25.93,91.27 25.93,85.43 22.64,82.14 | 61.63,22 61.63,65.62 62.01,66 82,66 84,68 84,74.95 R81.1 85.05,76.52 85.92,77.39 118,77.39 121.78,77.39 v124.41,80.02 | 61.63,22 61.63,19.13 58.5,16 v52,16 | 34,13.57 34.3,13.87 35.54,13.87 37.22,15.55 45,15.55 v47.46,15.55 | 20.41,82.14 22.64,82.14 | 61.63,22
  Bottom 0.22: v2,79 4.74,81.74 v5.75,81.74
  Bottom 0.4: v44.79,120.28 42.76,118.25 | 42.76,118.25 42.75,118.24 | 42.76,118.25 42.76,117.06 42.73,117.03 | v40.89,115.19 42.73,117.03 | 42.73,117.03 v42.73,115.85 | v42.7,106.39 v42.7,104.51 v42.71,104.5 v42.71,99 42.71,97.96 v41.87,97.12 | v49.8,84.14 50,83.94 v50,82
  Bottom 0.6: v30,16 29.98,16.02 29,16.02 v22.78,16.02 | C97.1 13.92,55.08 v21,48 | v2.92,63.55 2.92,65.28 v1.59,66.61 | v11.5,162.08 13,160.58 v13,156 | v32.6,155 v36.21,155 v36.22,154.99 | v40.6,151.44 v40.6,149.43 | C73.2 34,94.05 v30.83,94.05 | v47.46,15.55 47.91,16 v52,16 | v124.41,80.02 125.04,80.65 U$2.P$28 127,80 127,79 U$2.P$27
  other vias: 13.44,55.08 38,94.05
-12V_CLEAN
  Top 0.3: IC9.11 79.45,39 C111.1 78.9,38.6 77.2,40.3 77.2,45.4 78.95,47.15 C100.1 78.85,47.3
  Top 0.6: R81.2 87.02,72 C85.+ 87.95,71.42 C90.1 87.95,67 85.95,65 80.95,65 78.7,62.75 78.7,47.65 C100.1
-A5V  (via drill 0.3)
  Top 0.22: C6.- 34.1,177.28 34.1,177.15
  Top 0.3: 5.01,168.75 5.01,166.99
  Top 0.4: DAC_ULTRAVOLT_CTRL.P$30 41.2,161.98 C17.1 40.67,161.35 42.8,159.22 C19.- | DAC_ULTRAVOLT_CTRL.P$15 38,172.85 37.05,173.8 C11.1 37.05,174.2 34.1,177.15 34.1,177.4 | C30.- 51,131.53 49.29,133.24 v49.29,145.2 v49.3,145.21 | v49.11,119.02 49.25,119.16 49.25,130.1 50.62,131.47 | v46.46,111.69 46.46,108.16 47.78,106.84 51.44,106.84 52.42,107.82 52.42,109.06 56,112.64 | C63.- 58,111.03 58,108 59,107 v64,107 | v65.48,101.36 66,101.36 69.99,101.36 72.5,98.85 U$2.P$14
  Top 0.45: DAC_HV1_CTRL.P$15 56.8,126.8 55.6,128 C38.1 54.95,128.22 51.7,131.47 C30.- | DAC_HV1_CTRL.P$30 60,116.5 59,115.5 C58.1 58.15,114.95 56.23,113.03 C63.-
  Top 0.6: C17.1 39.35,161.35 38.69,160.69 38.69,158.78 37.04,157.13 v36,157.13 | C6.- 14.13,177.88 5.01,168.75 | 5.01,166.99 v10,162 | v12,160 14.87,157.13 v32.48,157.13 | C19.- 42.8,157.8 v43,158 | v46,159.55 47.8,159.55 48.74,158.61 v48.74,150.45 | C63.- 56,112.64 | C30.- 50.62,131.47
  Bottom 0.4: v49.11,119.02 49.11,116.77 48.26,115.92 48.26,113.58 46.46,111.78 v46.46,111.69 | v49.3,145.21 49.3,149.89 v48.74,150.45 | v64,107 65,106 65,101.84 v65.48,101.36
  Bottom 0.6: v36,157.13 v32.48,157.13 | v10,162 v12,160 | v43,158 44.55,159.55 v46,159.55
BOOT0  (via drill 0.3)
  Top 0.22: v88.57,138.6 88.57,139.65 97.69,148.77 97.69,230 99.39,231.7 103.32,231.7 103.87,232.25 103.87,233.66 104.85,234.64 105.47,234.64 105.47,239 | U1.60 88.57,134.41 v88.57,134.43 | X2.2 124.33,239.88 122.94,241.27 122.94,243.8 121.24,245.5 106.85,245.5 105.47,244.12 105.47,239.41 | 105.47,239.41 105.47,239 | R116.2 105.26,239.21 | 105.26,239.21 105.47,239 | 105.26,239.21 105.27,239.21 105.47,239.41
  Bottom 0.22: v88.57,138.6 v88.57,134.43
CS_ADC_FAST_HV1_FB
  Top 0.22: ADC_FAST_HV1_FB.6 56,31.52 60,35.52 60,66.49 61.38,67.87 75.63,67.87 78.69,70.93 78.69,77.82 79.87,79 121,79 124.44,82.44 124.44,116.73 108.65,132.52 102.41,132.52 U1.37
CS_ADC_HV1_ELECTRODE_CURRENT
  Top 0.22: 118.6,99.29 118.6,102.96 101.69,119.87 99.88,119.87 98.39,121.36 98.39,121.76 U1.17
  Top 0.3: 118.6,99.29 118.31,99 ADC_HV1_ELECTRODE_CURRENT.6
CS_ADC_HV1_FG
  Top 0.22: ADC_HV1_FG.6 62.58,92 66.87,87.71 66.87,72.5 67.27,72.1 73.21,72.1 73.91,72.8 73.91,80.16 76.28,82.53 118.68,82.53 120.32,84.17 120.32,103.37 100.36,123.33 | 100.36,123.33 100.35,123.34 | 100.36,123.33 U1.22
CS_ADC_SLOW_HV1_FB  (via drill 0.3)
  Top 0.22: ADC_SLOW_HV1_FB.23 41.92,25.57 42.3,25.2 44.1,25.2 44.6,25.7 44.6,31.6 45.24,32.24 46.79,32.24 | v49,34.36 55.36,34.36 57.76,36.76 57.76,67.32 60.29,69.85 74.5,69.85 76.48,71.83 76.48,78.89 78.55,80.96 119.51,80.96 122.03,83.48 122.03,116.18 107.45,130.76 103.47,130.76 U1.33
  Top 0.3: 46.79,32.24 v46.82,32.21
  Bottom 0.22: v46.82,32.21 48.97,34.36
  Bottom 0.3: 48.97,34.36 v49,34.36
CS_ADC_TEMP_DAC_HV1_CTRL  (via drill 0.3)
  Top 0.22: 65,145 67.07,145 73.99,138.08 v73.99,138.06 | 92.61,134.61 89.71,137.51 82,137.51 77.63,137.51 v77.29,137.85 | 92.61,134.61 92.67,134.55 | 92.61,134.61 U1.54
  Top 0.3: ADC_TEMP_DAC_HV1_CTRL.6 65,145
  Bottom 0.22: v73.99,138.06 74.05,138 77.14,138 v77.29,137.85
CS_DISPLAY  (via drill 0.3)
  Top 0.22: U1.26 v121.28,105.24 | v126.08,100.39 126.12,100.35 126.12,13.01 120.58,7.47 109.35,7.47 108.24,6.36 JP1.4
  Bottom 0.22: v121.28,105.24 126.08,100.44 v126.08,100.39
CS_TC_RES_STACK
  Top 0.22: 83.64,7.21 83.92,6.92 84.14,6.7 85.75,6.7 85.78,6.73 85.78,6.76 86.97,7.95 120.36,7.95 125.62,13.21 125.62,101.01 125.02,101.61 125.02,116.94 109.01,132.95 102.13,132.95 U1.38
  Top 0.3: TC1.6 83.64,7.21
GAIN_A
  Top 0.22: MUX1.P$10 82.95,94 83.19,94.24 83.19,94.62 82.89,94.92 76.93,94.92 75.13,93.12 75.13,86.77 78.85,83.05 118.3,83.05 119.72,84.47 119.72,103.26 99.56,123.42 | 99.56,123.42 U1.21 | 99.56,123.42
GAIN_B
  Top 0.22: MUX1.P$1 76.6,94 75.56,92.96 75.56,87 79,83.56 118.02,83.56 119.15,84.69 119.15,103.12 U1.20
GND  (via drill 0.3)
  Top 0.22: 91,129 91,129.86 U1.63 89.58,131.28 89.58,131.86 88.67,132.77 87.91,132.77 C33.2 | U1.12 95,125.11 95,126 | v96.52,124.15 96.71,124.15 U1.18 98.82,122.04 98.82,121.64 99.54,120.92 C47.2 100.5,120.92 v100.89,120.53 | U1.28 101,126.93 v101,129 | C39.2 85.22,127 85,127 85,126.78 C41.2 84.77,123.01 C44.2 | 92,121.15 92,121 | C50.2 89.82,117.96 | 89.82,117.96 C53.2 | v89.39,117.96 89.82,117.96 | C40.2 104.78,125.33 C43.2 105.71,125.27 v105.72,125.26 | v101,140 101,138.52 C29.2 C27.2 98,139.6 98,140
  Top 0.3: ADC_SLOW_HV1_FB.3 41.26,31.93 v41.26,33.44 40.62,32.8 ADC_SLOW_HV1_FB.4 | ADC_SLOW_HV1_FB.20 39.98,26.88 42.03,28.93 v42.96,28.93 43,28.93 43.39,29.32 v43.39,32.33 | DAC_ULTRAVOLT_CTRL.P$11 41.2,170.96 42.2,169.96 v42.59,169.96 42.59,169.41 | DAC_ULTRAVOLT_CTRL.P$6 43.09,168.91 42.59,169.41 | DAC_ULTRAVOLT_CTRL.P$5 42.91,168.11 42.59,168.43 42.59,169.41 | C46.2 92,121.15 v92,120
  Top 0.4: C122.2 56.05,29.05 v58,31 | v59.9,34.46 59.9,33.9 59,33
  Top 0.45: DAC_HV1_CTRL.P$11 60,124 61,123 | 61,123 DAC_HV1_CTRL.P$6 | DAC_HV1_CTRL.P$5 61.8,122.2 61,123
  Top 0.6: X3.7 105.65,230.45 105.72,230.52
  Bottom 0.22: v100.89,120.53 100.89,120.89 101,121 | v105.72,125.26 105.74,125.26 106,125
  other vias: 38,217 112,236 61,90 115,92 115,88 115,96 120,109 120,112 117,112 114,115 120,116 118,118 115,121 111,118 108,121 112,124 109,127 104.41,142.47 107.47,145.58 110.56,148.69 107,136 110,139 113,142 116,145 119,148 119,152 119,156 112,153 112,157 112,161 112,166 119,160 119,165 112,171 119,170 112,176 112,181 119,180 119,175 112,186 119,185 119,190 112,191 112,196 119,195 119,200 112,201 112,207 119,206 112,213 119,212 112,219 119,218 112,226.11 123,222 128,228 123,233 111.98,231.25 117.42,236.57 102,219 102,213 102,207 102,201 102,195 102,189 102,183 102,177 102,171 102,165 102,159 102,153 102,148 98,143 93,151 93,156 93,161 93,166 93,171 93,177 93,183 93,189 93,195 93,201 93,207 93,213 92,218 87,218 82,218 77,218 71,218 71,223 77,223 78,229 78,227 92,225 94,223 91,235 89,235 94,244 90,244 74,245 78,245 73,236 75,235 69,233 69,228 46,228 47,224 35,228 35,221 34,217 27,217 27,211 62,216 54,216 43,215 42,208 42,200 42,193 42,186 47,180 51,175 49,170 55,170 60,166 64,162 68,158 71,153 71,147 75,143 80,140 86,142 90,146 67,143 70,141 68,137 69,132 73.45,136.34 82,134 84,134 92,141 92,137 92,129 96.52,133.61 88,129 79,133 80,129 74,130 63.92,126.53 63,118 67,119 72.76,118.36 77,120 80,124 69.38,126.08 63,141 62.53,137.61 63,132 69,115 76,115 82,119 86,115 107,112 110,109 111,134 115,130 119,126 123,122 127,117 127,111 127,106 102,114 61,124 56,71 59,74 64,74 65,77 65,82 65,87 65.42,95.06 68,92 70,83 70,80 70,76 82,10 122.67,19 122.67,27.02 122.69,36.02 122.7,45.97 122.64,55 122.74,64 123,7 127,11 128.46,20.77 128.56,29.96 128.51,37.7 128.51,47.88 128.56,57.3 128.6,67.01 93,7 100,2 110,2 121,2 48.66,163.14 56.13,161.36 60.47,157.3 63.36,151.75 49.79,30.01 55.03,29.51 44,24 41.67,28.03 92.73,118.79 85.05,128.43 84.93,123.75 117.51,102.42 115.78,104.41 104,244 100.86,240.65 104,236 96,226 85,233 89,229 100.15,230.49